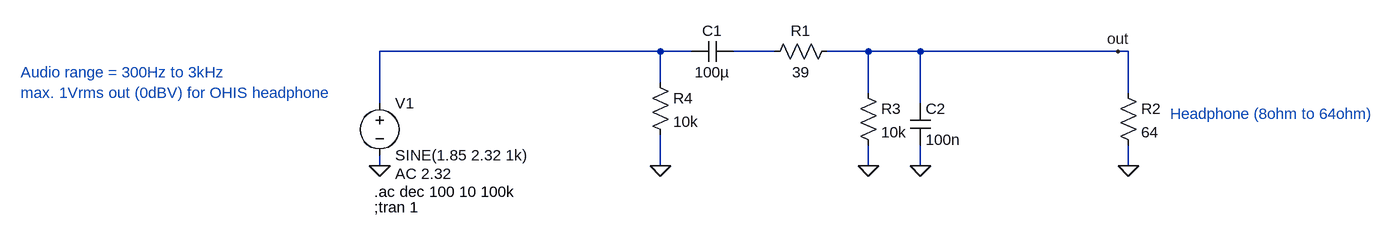
[diagram p0: schematic FT-65E.asc]
FT-65E.asc, the LTspice schematic file:
Version 4
SHEET 1 1592 680
WIRE 464 64 32 64
WIRE 512 64 464 64
WIRE 640 64 576 64
WIRE 784 64 720 64
WIRE 864 64 784 64
WIRE 1168 64 864 64
WIRE 1184 64 1168 64
WIRE 464 112 464 64
WIRE 784 128 784 64
WIRE 1184 128 1184 64
WIRE 32 144 32 64
WIRE 864 144 864 64
WIRE 32 240 32 224
WIRE 464 240 464 192
WIRE 784 240 784 208
WIRE 864 240 864 208
WIRE 1184 240 1184 208
FLAG 1184 240 0
FLAG 32 240 0
FLAG 1168 64 out
FLAG 864 240 0
FLAG 784 240 0
FLAG 464 240 0
SYMBOL voltage 32 128 R0
WINDOW 123 24 124 Left 2
WINDOW 39 0 0 Left 0
SYMATTR Value2 AC 2.32
SYMATTR InstName V1
SYMATTR Value SINE(1.85 2.32 1k)
SYMBOL res 736 48 R90
WINDOW 0 0 56 VBottom 2
WINDOW 3 32 56 VTop 2
SYMATTR InstName R1
SYMATTR Value 39
SYMBOL cap 576 48 R90
WINDOW 0 0 32 VBottom 2
WINDOW 3 32 32 VTop 2
SYMATTR InstName C1
SYMATTR Value 100µ
SYMBOL res 1168 112 R0
SYMATTR InstName R2
SYMATTR Value 64
SYMBOL cap 848 144 R0
SYMATTR InstName C2
SYMATTR Value 100n
SYMBOL res 768 112 R0
SYMATTR InstName R3
SYMATTR Value 10k
SYMBOL res 448 96 R0
SYMATTR InstName R4
SYMATTR Value 10k
TEXT 24 280 Left 2 !.ac dec 100 10 100k
TEXT -520 96 Left 2 ;Audio range = 300Hz to 3kHz\nmax. 1Vrms out (0dBV) for OHIS headphone
TEXT 24 304 Left 2 !;tran 1
TEXT 1248 160 Left 2 ;Headphone (8ohm to 64ohm)

The netlist it stands for:
* FT-65E.asc
V1 N001 0 SINE(1.85 2.32 1k) AC 2.32
R1 out N002 39
C1 N002 N001 100µ
R2 out 0 64
C2 out 0 100n
R3 out 0 10k
R4 N001 0 10k
.ac dec 100 10 100k
* Audio range = 300Hz to 3kHz
* max. 1Vrms out (0dBV) for OHIS headphone
;tran 1
* Headphone (8ohm to 64ohm)
.backanno
.end